# EAGLE schematic eagle-import-testfile (EAGLE 8.2.1)

## Sheet 1 of 2: Sheet1
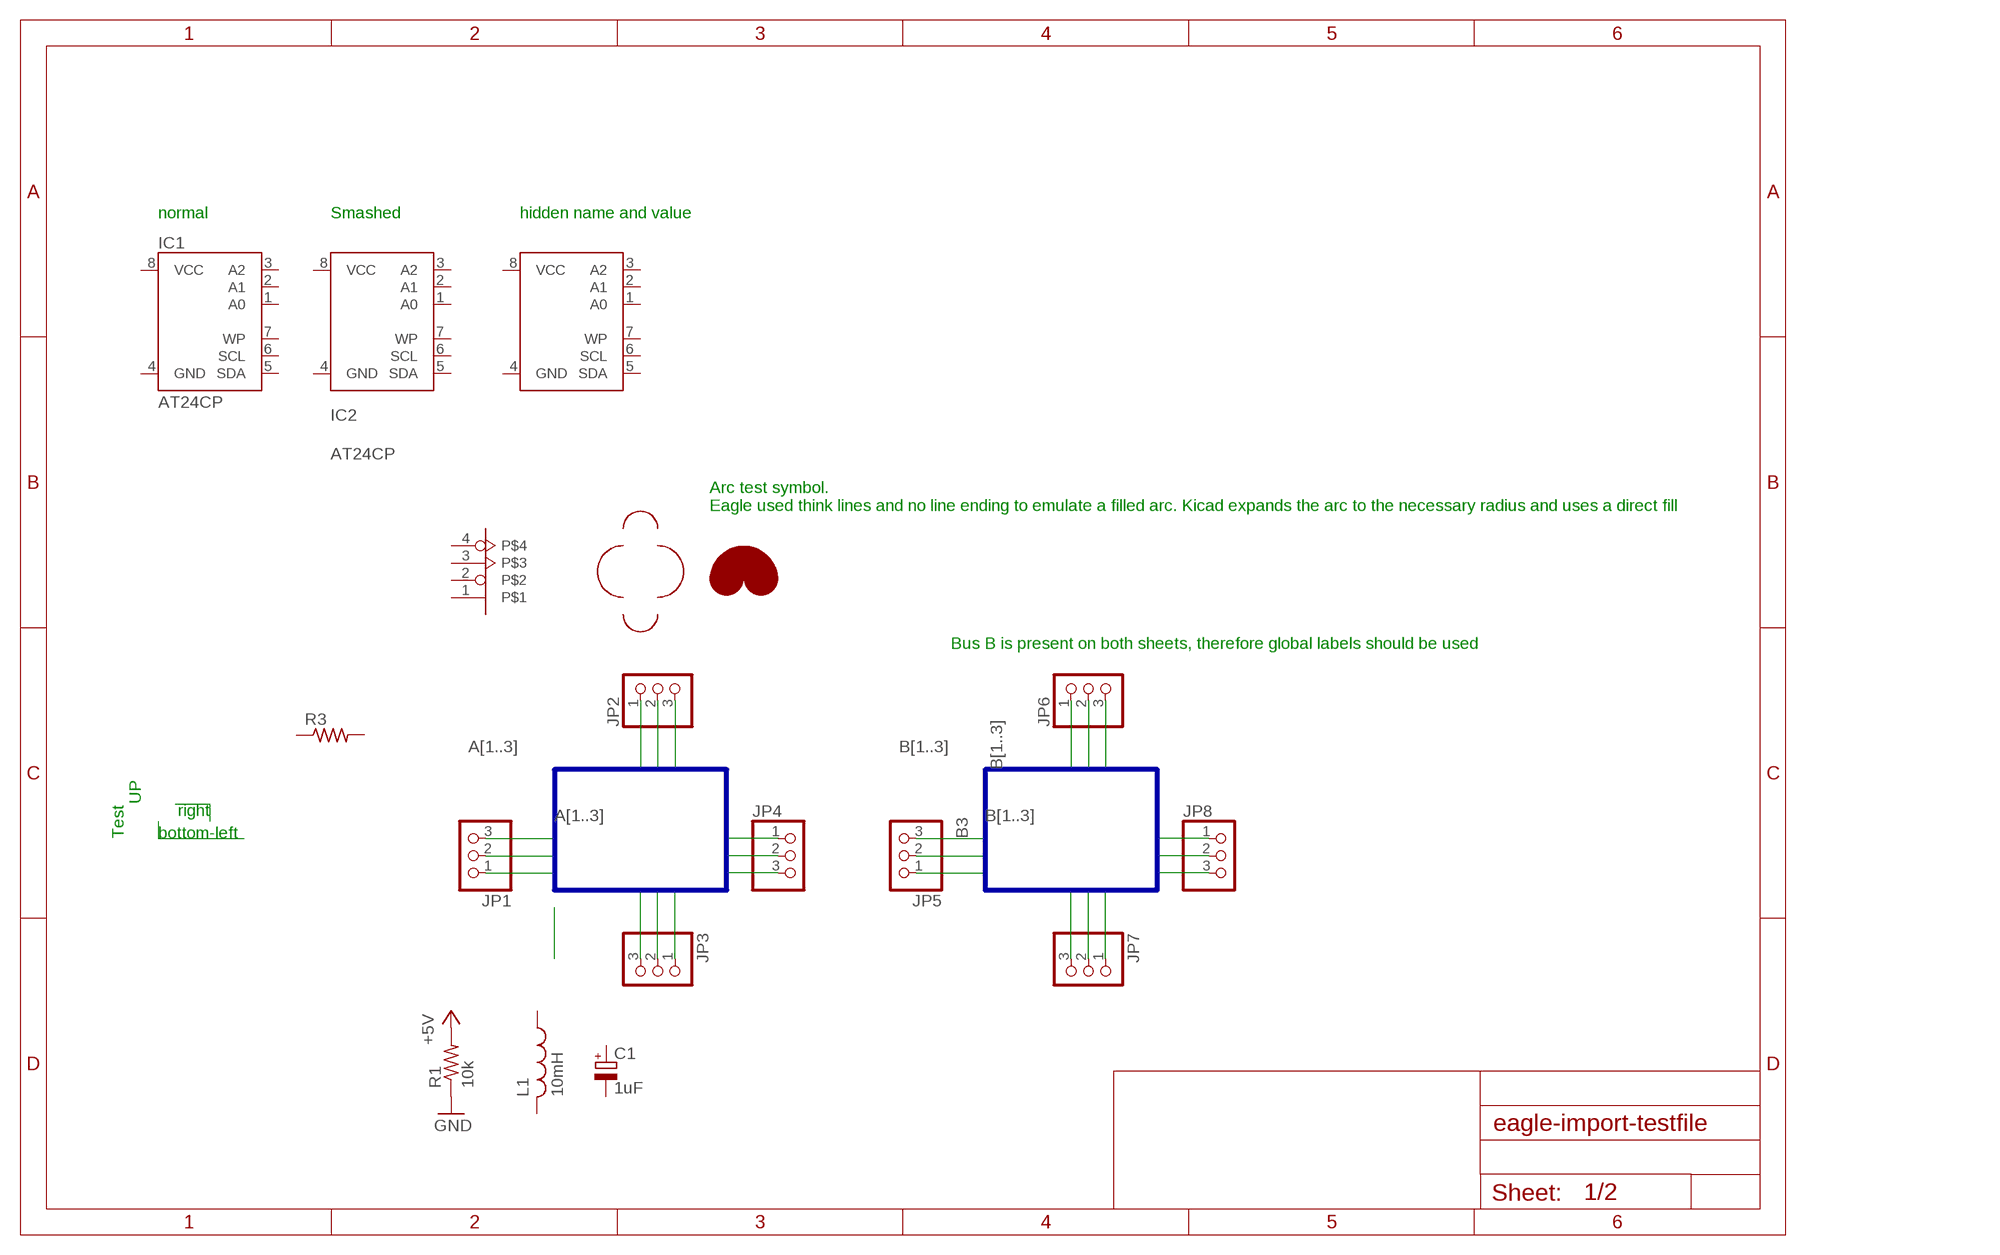
[diagram p0: schematic, sheet 1]

### Parts
C1  1uF  CPOL-EU085CS-1AR  [085CS_1AR]
IC1  AT24CP  [DIL08]
IC2  AT24CP  [DIL08]
IC3  AT24CP  [DIL08]
JP1  PINHD-1X3  [1X03]
JP2  PINHD-1X3  [1X03]
JP3  PINHD-1X3  [1X03]
JP4  PINHD-1X3  [1X03]
JP5  PINHD-1X3  [1X03]
JP6  PINHD-1X3  [1X03]
JP7  PINHD-1X3  [1X03]
JP8  PINHD-1X3  [1X03]
L1  10mH  L-USL2012C  [L2012C]
R1  10k  R-US_R0603  [R0603]
R3  R-US_0204/2V  [0204V]
U$2  PINSHAPETEST  [1X04]

### Nets
+5V: R1.2
A1: JP1.1 JP2.1 JP3.1 JP4.1
A2: JP1.2 JP2.2 JP3.2 JP4.2
A3: JP1.3 JP2.3 JP3.3 JP4.3
B1: JP5.1 JP6.1 JP7.3 JP8.1 ; also sheet 2
B2: JP5.2 JP6.2 JP7.2 JP8.2 ; also sheet 2
B3: JP5.3 JP6.3 JP7.1 JP8.3 ; also sheet 2
GND: R1.1
Unconnected: C1.+ C1.- IC1.1(A0) IC1.2(A1) IC1.3(A2) IC1.5(SDA) IC1.6(SCL) IC1.7(WP) IC2.1(A0) IC2.2(A1) IC2.3(A2) IC2.5(SDA) IC2.6(SCL) IC2.7(WP) IC3.1(A0) IC3.2(A1) IC3.3(A2) IC3.5(SDA) IC3.6(SCL) IC3.7(WP) L1.1 L1.2 R3.1 R3.2 U$2.1 U$2.2 U$2.3 U$2.4

### Buses
A[1..3]
B[1..3]

### Notes on the sheet
- normal | Smashed | hidden name and value
- Arc test symbol.
  Eagle used think lines and no line ending to emulate a filled arc. Kicad expands the arc to the necessary radius and uses a direct fill
- Bus B is present on both sheets, therefore global labels should be used
- UP | right
- Test | bottom-left

## Sheet 2 of 2
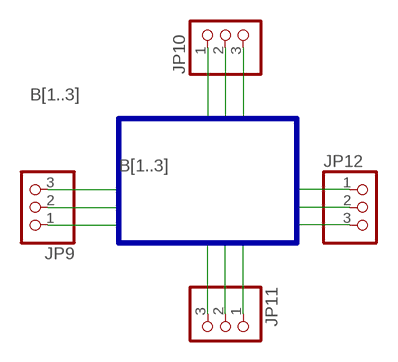
[diagram p1: schematic, sheet 2]

### Parts
JP9  PINHD-1X3  [1X03]
JP10  PINHD-1X3  [1X03]
JP11  PINHD-1X3  [1X03]
JP12  PINHD-1X3  [1X03]

### Nets
B1: JP9.1 JP10.1 JP11.3 JP12.1 ; also sheet 1
B2: JP9.2 JP10.2 JP11.2 JP12.2 ; also sheet 1
B3: JP9.3 JP10.3 JP11.1 JP12.3 ; also sheet 1

### Buses
B[1..3]

## Power pins joined to a net without a drawn wire
GND: IC1.4(GND) IC2.4(GND) IC3.4(GND)
VCC: IC1.8(VCC) IC2.8(VCC) IC3.8(VCC)

## Library data of the parts
C1 = rcl:CPOL-EU: POLARIZED CAPACITOR, European symbol
IC1-IC3 = atmel:AT24C*: 2-wire serial EEPROM; MPN: AT24C1024BW-SH-B; OC_FARNELL: 1362646; OC_NEWARK: 03P2044
JP1-JP12 = pinhead:PINHD-1X3: PIN HEADER
L1 = rcl:L-US: INDUCTOR, American symbol
R1 R3 = resistor:R-US_: RESISTOR, American symbol
U$2 = pinhead:PINSHAPETEST